# EAGLE schematic tick-mk-5.0.0 (EAGLE 6.5.0)
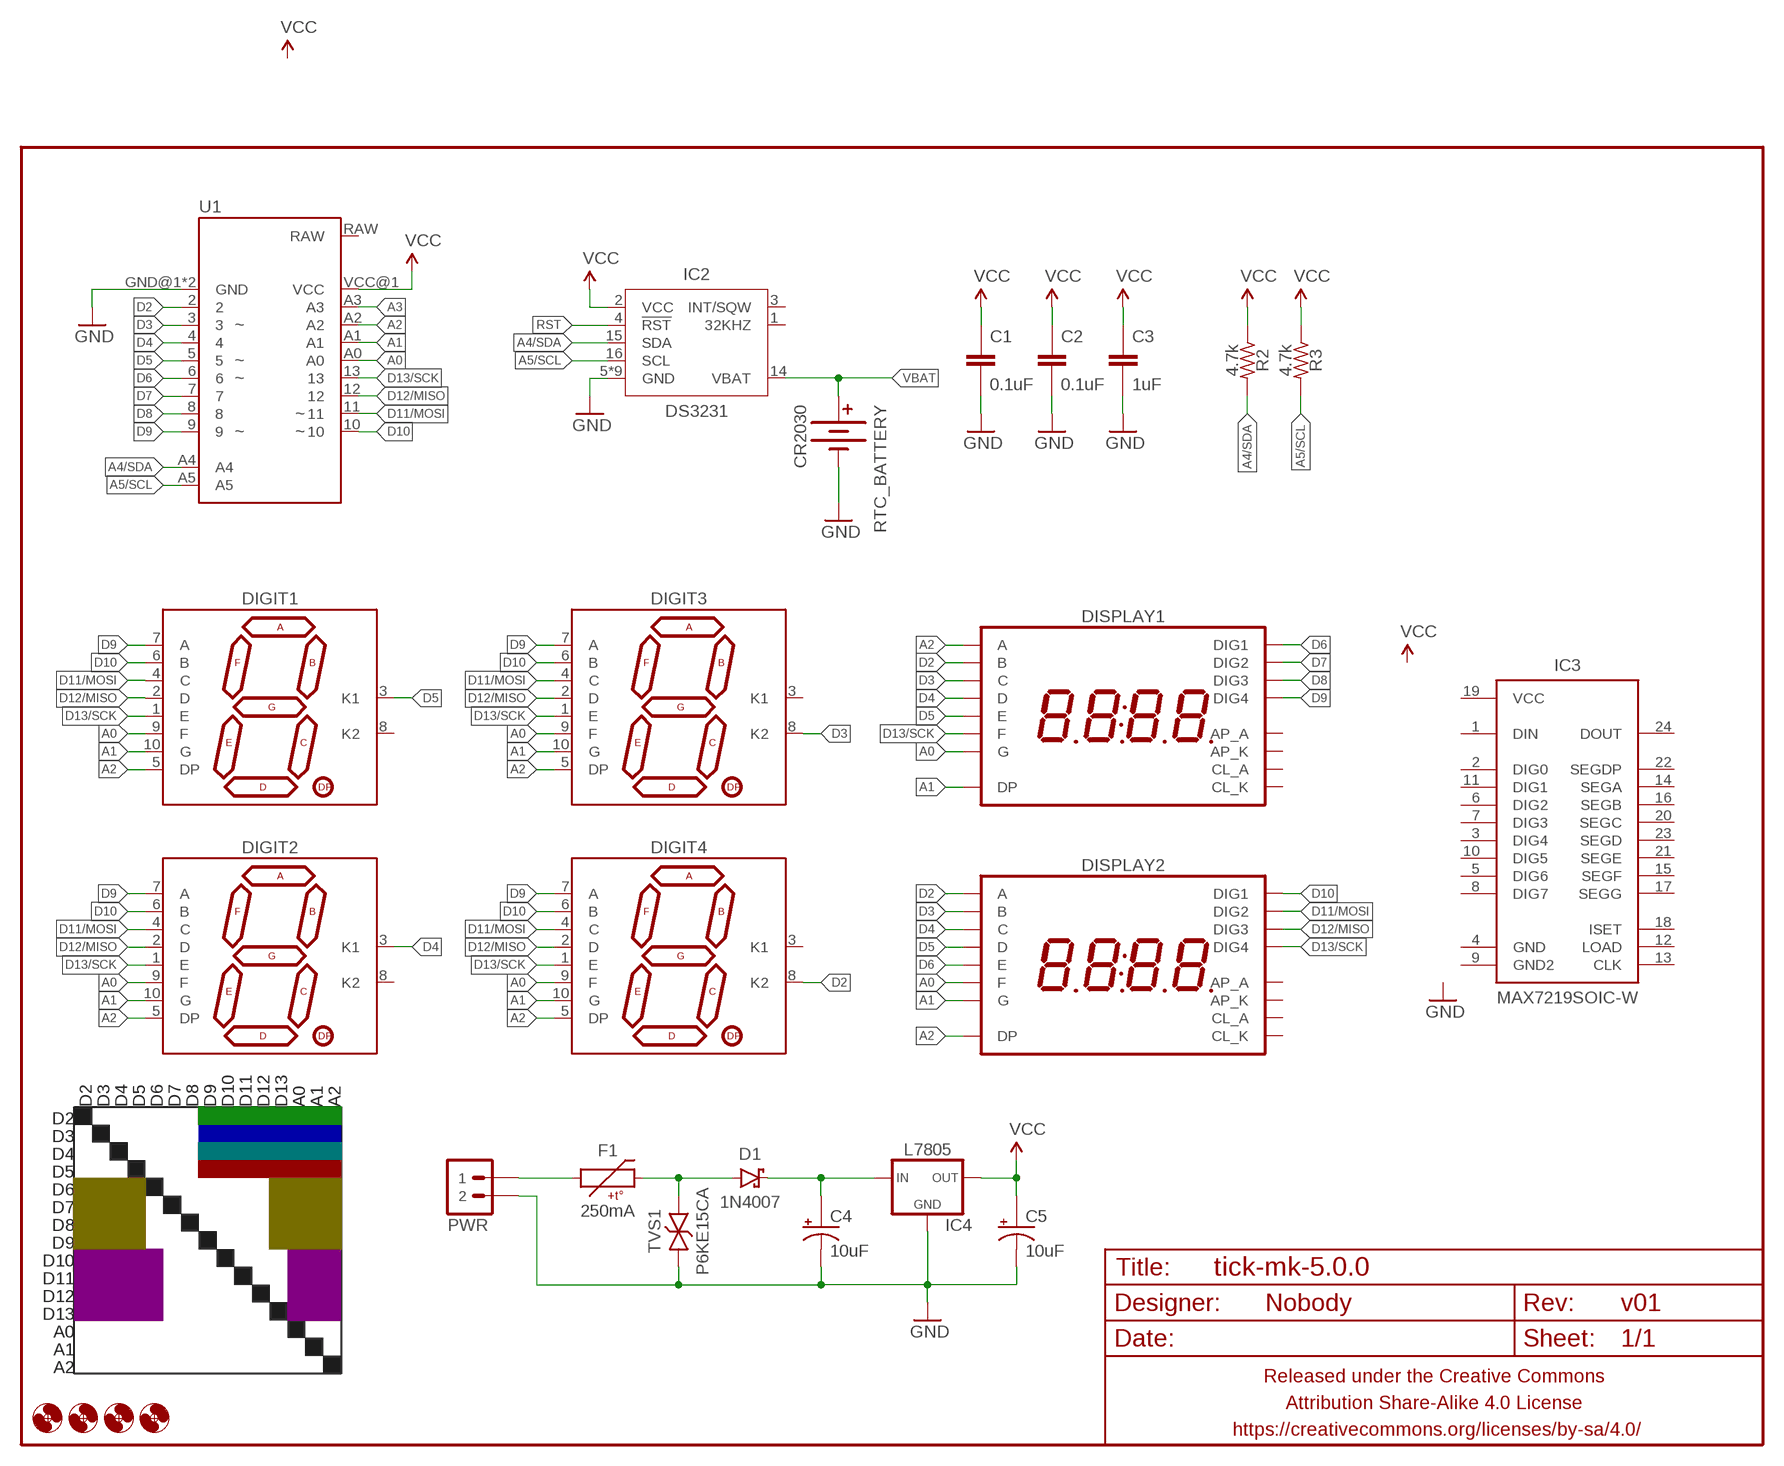
[diagram p0: schematic, sheet 1]

## Parts
C1  0.1uF  CAPACITOR-CERAMIC025-024X044  [C025-024X044]
C2  0.1uF  CAPACITOR-CERAMIC025-024X044  [C025-024X044]
C3  1uF  CAPACITOR-CERAMIC025-024X044  [C025-024X044]
C4  10uF  CAPACITOR-POLARIZEDE2-5  [E2-5]
C5  10uF  CAPACITOR-POLARIZEDE2-5  [E2-5]
D1  1N4007  DIODE-SCHOTTKYPTH-10.16MM  [DIODE-10.16MM]
DIGIT1  7SEG_1DIGPTH-25.4MM-BARE  [7SEG_1DIG_25.4MM_NOSILK]
DIGIT2  7SEG_1DIGPTH-25.4MM-BARE  [7SEG_1DIG_25.4MM_NOSILK]
DIGIT3  7SEG_1DIGPTH-25.4MM-BARE  [7SEG_1DIG_25.4MM_NOSILK]
DIGIT4  7SEG_1DIGPTH-25.4MM-BARE  [7SEG_1DIG_25.4MM_NOSILK]
DISPLAY1  7SEG_4DIGIT_COLON_APOS  [7SEG_4DIG_10MM]
DISPLAY2  7SEG_4DIGIT_COLON_APOS  [7SEG_4DIG_10MM]
F1  250mA  PTCPTH-5.08MM  [PTC-PTH-5.08MM]
FRAME1  FRAME-LETTERNO_PACKAGE  [DUMMY]
H1  HOLE2,5  [2,5]
H2  HOLE2,5  [2,5]
H3  HOLE2,5  [2,5]
H4  HOLE2,5  [2,5]
IC2  DS3231  [SO16W]
IC3  MAX7219SOIC-W  [SO24W]
IC4  L7805  V_REG_78XXTO-220-THERMPAD  [TO220-IGO-THERMPAD]
PWR  M02JST-PTH-VERT  [JST-2-PH-VERT-PTH]
R2  4.7k  RESISTORPTH-AXIAL-6.35MM  [RESISTOR-AXIAL-PTH-6.35MM]
R3  4.7k  RESISTORPTH-AXIAL-6.35MM  [RESISTOR-AXIAL-PTH-6.35MM]
RTC_BATTERY  CR2030  BATTERY20MM_SMD_TIGHT  [BATTCON_20MM_MINE_STAHPIT]
TVS1  P6KE15CA  TVSDO-41-10.16MM  [DO-41-TVS-BI-10.16MM]
U1  ARDUINO_PRO_MINI_TICK2  [ARDUINO_PRO_MINI_TICK2]

## Nets
A0: DIGIT1.9(F) DIGIT2.9(F) DIGIT3.9(F) DIGIT4.9(F) DISPLAY1.15(G) DISPLAY2.11(F) U1.A0
A1: DIGIT1.10(G) DIGIT2.10(G) DIGIT3.10(G) DIGIT4.10(G) DISPLAY1.7(DP) DISPLAY2.15(G) U1.A1
A2: DIGIT1.5(DP) DIGIT2.5(DP) DIGIT3.5(DP) DIGIT4.5(DP) DISPLAY1.14(A) DISPLAY2.7(DP) U1.A2
A3: U1.A3
A4/SDA: IC2.15(SDA) R2.P$2 U1.A4
A5/SCL: IC2.16(SCL) R3.P$2 U1.A5
D2: DIGIT4.8(K2) DISPLAY1.16(B) DISPLAY2.14(A) U1.2
D3: DIGIT3.8(K2) DISPLAY1.13(C) DISPLAY2.16(B) U1.3
D4: DIGIT2.3(K1) DISPLAY1.3(D) DISPLAY2.13(C) U1.4
D5: DIGIT1.3(K1) DISPLAY1.5(E) DISPLAY2.3(D) U1.5
D6: DISPLAY1.1(DIG1) DISPLAY2.5(E) U1.6
D7: DISPLAY1.2(DIG2) U1.7
D8: DISPLAY1.6(DIG3) U1.8
D9: DIGIT1.7(A) DIGIT2.7(A) DIGIT3.7(A) DIGIT4.7(A) DISPLAY1.8(DIG4) U1.9
D10: DIGIT1.6(B) DIGIT2.6(B) DIGIT3.6(B) DIGIT4.6(B) DISPLAY2.1(DIG1) U1.10
D11/MOSI: DIGIT1.4(C) DIGIT2.4(C) DIGIT3.4(C) DIGIT4.4(C) DISPLAY2.2(DIG2) U1.11
D12/MISO: DIGIT1.2(D) DIGIT2.2(D) DIGIT3.2(D) DIGIT4.2(D) DISPLAY2.6(DIG3) U1.12
D13/SCK: DIGIT1.1(E) DIGIT2.1(E) DIGIT3.1(E) DIGIT4.1(E) DISPLAY1.11(F) DISPLAY2.8(DIG4) U1.13
GND: C1.2 C2.2 C3.2 C4.- C5.- IC2.5(GND) IC2.6(GND) IC2.7(GND) IC2.8(GND) IC2.9(GND) IC2.10(GND) IC2.11(GND) IC2.12(GND) IC2.13(GND) IC4.4(GND) IC4.GND PWR.2 RTC_BATTERY.BOTTOM(-) TVS1.P$1 U1.GND@1(GND) U1.GND@2(GND)
N$4: D1.A F1.P$2 TVS1.P$2
N$7: F1.P$1 PWR.1
N$8: C4.+ D1.C IC4.IN
RST: IC2.4(!RST)
VBAT: IC2.14(VBAT) RTC_BATTERY.TOP@1(+) RTC_BATTERY.TOP@2(+)
VCC: C1.1 C2.1 C3.1 C5.+ IC2.2(VCC) IC4.OUT R2.P$1 R3.P$1 U1.VCC@1(VCC)
Unconnected: DIGIT1.8(K2) DIGIT2.8(K2) DIGIT3.3(K1) DIGIT4.3(K1) DISPLAY1.4(CL_A) DISPLAY1.9(AP_K) DISPLAY1.10(AP_A) DISPLAY1.12(CL_K) DISPLAY2.4(CL_A) DISPLAY2.9(AP_K) DISPLAY2.10(AP_A) DISPLAY2.12(CL_K) IC2.1(32KHZ) IC2.3(INT/SQW) IC3.1(DIN) IC3.2(DIG0) IC3.3(DIG4) IC3.4(GND) IC3.5(DIG6) IC3.6(DIG2) IC3.7(DIG3) IC3.8(DIG7) IC3.9(GND2) IC3.10(DIG5) IC3.11(DIG1) IC3.12(LOAD) IC3.13(CLK) IC3.14(SEGA) IC3.15(SEGF) IC3.16(SEGB) IC3.17(SEGG) IC3.18(ISET) IC3.19(VCC) IC3.20(SEGC) IC3.21(SEGE) IC3.22(SEGDP) IC3.23(SEGD) IC3.24(DOUT) U1.RAW

## Notes on the sheet
- D2 | D3 | D4 | D5 | D6 | D7 | D8 | D9 | D10 | D11 | D12 | D13 | A0 | A1 | A2
- D2
- D3
- D4
- D5
- D6
- D7
- D8
- D9
- D10
- D11
- D12
- D13
- A0
- A1
- A2

## Library data of the parts
C1-C3 = A_butts:CAPACITOR-CERAMIC: CAPACITOR, European symbol
C4 C5 = A_butts:CAPACITOR-POLARIZED: POLARIZED CAPACITOR, American symbol
D1 = A_butts:DIODE-SCHOTTKY: Schottky diodes in SFE's production catalog BAT20J 1A 23V 0.62Vf RB751 120mA 40V 0.37Vf PMEG4005EJ 0.5A 40V 0.42Vf MBRA140 1A 40V 0.5Vf B340A 3A 40V SMA
DIGIT1-DIGIT4 = A_butts:7SEG_1DIG
DISPLAY1 DISPLAY2 = A_butts:7SEG_4DIGIT_COLON_APOS
F1 = A_butts:PTC: Resettable Fuse PTC Resettable Fuse. Spark Fun Electronics SKU : COM-08357
FRAME1 = A_butts:FRAME-LETTER: Schematic Frame Standard 8.5x11 US Letter frame; DESIGNER: Nobody; VERSION: v01
H1-H4 = A_butts:HOLE: MOUNTING HOLE with drill center marker
IC2 = A_butts:DS3231
IC3 = A_butts:MAX7219: 8-digit, 8-segment LED display driver, serial input
IC4 = A_butts:V_REG_78XX: Voltage Regulator Standard 7805 5V regulator. IGO (Input Ground Output). Spark Fun Electronics SKU : COM-00107
PWR = A_butts:M02: Standard 2-pin 0.1" header. Use with - straight break away headers ( PRT-00116) - right angle break away headers (PRT-00553) - swiss pins (PRT-00743) - machine pins (PRT-00117) - female headers (PRT-00115) Molex polarized connector foot print use with: PRT-08233 with associated crimp pins and housings. 2.54_SCREWTERM for use with PRT-10571. 3.5mm Screw Terminal footprints for PRT-08084 5mm Screw Terminal footprints for use with PRT-08433
R2 R3 = A_butts:RESISTOR: RESISTOR, American symbol
RTC_BATTERY = A_butts:BATTERY: Battery Holders Various common sizes : AA, AAA, 20mm coin cell and 12mm coin cell. 20MM_4LEGS, BATT-10373
TVS1 = A_butts:TVS: Transient voltage suppressor- prevents ESD on inputs. Ignore package description- MBRA140 is NOT this type of part!!!
U1 = A_butts:ARDUINO_PRO_MINI_TICK2